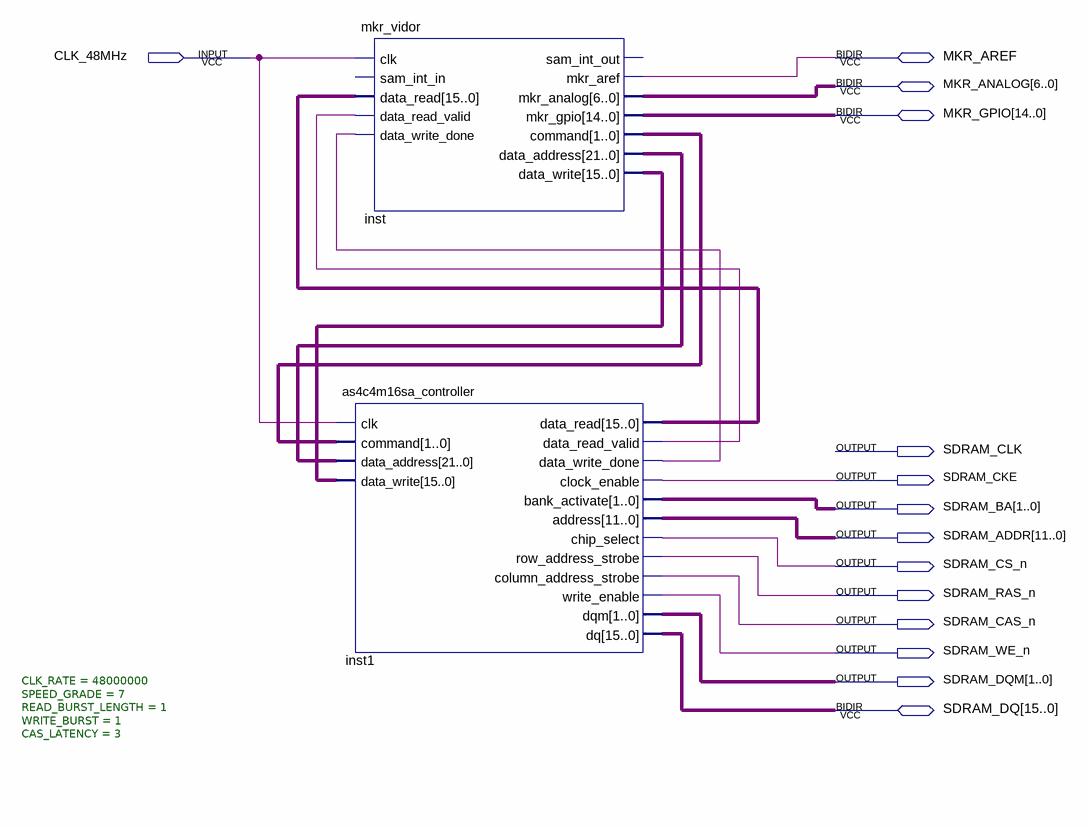
[diagram p0: schematic sheet]
// Quartus schematic mkr_vidor_anpr.bdf as structural Verilog: 2 symbols, 14 pins
module mkr_vidor_anpr (
  input  CLK_48MHz,
  inout  MKR_AREF,
  inout  [6:0] MKR_ANALOG,
  inout  [14:0] MKR_GPIO,
  inout  [15:0] SDRAM_DQ,
  output SDRAM_CLK,
  output SDRAM_CKE,
  output [1:0] SDRAM_BA,
  output [11:0] SDRAM_ADDR,
  output SDRAM_CS_n,
  output SDRAM_RAS_n,
  output SDRAM_CAS_n,
  output SDRAM_WE_n,
  output [1:0] SDRAM_DQM
);

  wire inst1_data_read_valid, inst1_data_write_done;
  wire [1:0] inst_command;
  wire [15:0] inst1_data_read, inst_data_write;
  wire [21:0] inst_data_address;

  mkr_vidor inst (
    .clk(CLK_48MHz), .data_read(inst1_data_read), .data_read_valid(inst1_data_read_valid),
    .data_write_done(inst1_data_write_done), .command(inst_command), .data_address(inst_data_address),
    .data_write(inst_data_write), .mkr_aref(MKR_AREF), .mkr_analog(MKR_ANALOG), .mkr_gpio(MKR_GPIO));  // open: sam_int_in, sam_int_out
  as4c4m16sa_controller #(.CLK_RATE(48000000), .SPEED_GRADE(7), .READ_BURST_LENGTH(1), .WRITE_BURST(1), .CAS_LATENCY(3)) inst1 (
    .clk(CLK_48MHz), .command(inst_command), .data_address(inst_data_address), .data_write(inst_data_write),
    .data_read(inst1_data_read), .data_read_valid(inst1_data_read_valid),
    .data_write_done(inst1_data_write_done), .clock_enable(SDRAM_CKE), .bank_activate(SDRAM_BA),
    .address(SDRAM_ADDR), .chip_select(SDRAM_CS_n), .row_address_strobe(SDRAM_RAS_n),
    .column_address_strobe(SDRAM_CAS_n), .write_enable(SDRAM_WE_n), .dqm(SDRAM_DQM), .dq(SDRAM_DQ));
endmodule
